# Altium schematic sheet ngh-dram.SchDoc
size A4
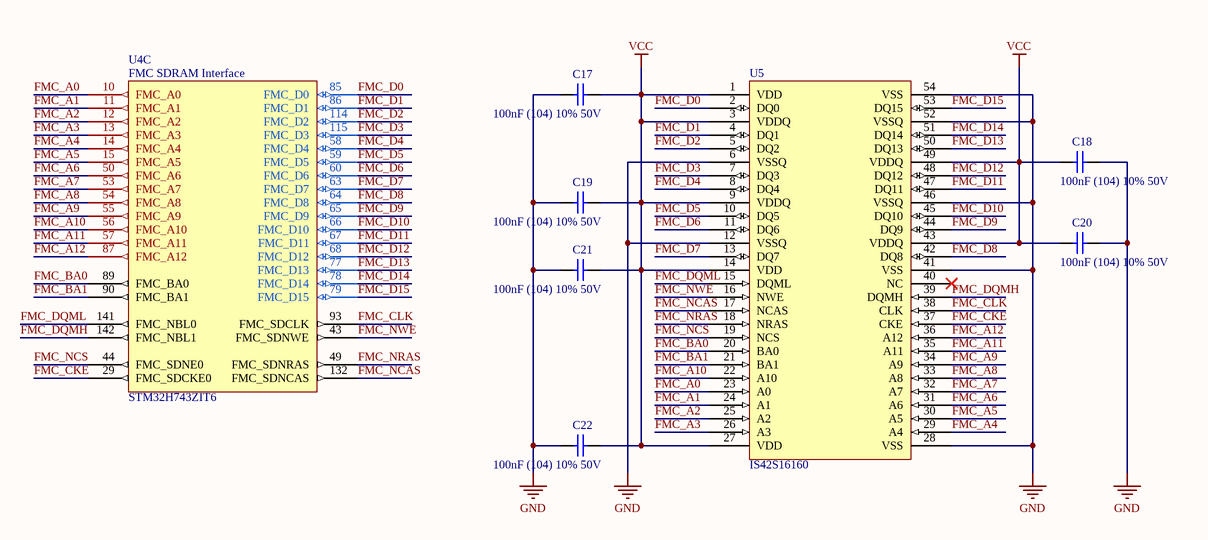
[diagram p0: ngh-dram.SchDoc]

## Parts
C17  100nF (104) 10% 50V  [0603_C]
C18  100nF (104) 10% 50V  [0603_C]
C19  100nF (104) 10% 50V  [0603_C]
C20  100nF (104) 10% 50V  [0603_C]
C21  100nF (104) 10% 50V  [0603_C]
C22  100nF (104) 10% 50V  [0603_C]
U4  STM32H743ZIT6  [LQFP-144_20x20]  (part C of 6)
U5  IS42S16160  [TSOP54-II]

## Nets
GND: C17.2 C18.1 C19.2 C20.1 C21.2 C22.2 U5.6(VSSQ) U5.12(VSSQ) U5.28(VSS) U5.41(VSS) U5.46(VSSQ) U5.52(VSSQ) U5.54(VSS)
VCC: C17.1 C18.2 C19.1 C20.2 C21.1 C22.1 U5.1(VDD) U5.3(VDDQ) U5.9(VDDQ) U5.14(VDD) U5.27(VDD) U5.43(VDDQ) U5.49(VDDQ)
FMC_A0: U4.10(FMC_A0) U5.23(A0)
FMC_A1: U4.11(FMC_A1) U5.24(A1)
FMC_A2: U4.12(FMC_A2) U5.25(A2)
FMC_A3: U4.13(FMC_A3) U5.26(A3)
FMC_A4: U4.14(FMC_A4) U5.29(A4)
FMC_A5: U4.15(FMC_A5) U5.30(A5)
FMC_A6: U4.50(FMC_A6) U5.31(A6)
FMC_A7: U4.53(FMC_A7) U5.32(A7)
FMC_A8: U4.54(FMC_A8) U5.33(A8)
FMC_A9: U4.55(FMC_A9) U5.34(A9)
FMC_A10: U4.56(FMC_A10) U5.22(A10)
FMC_A11: U4.57(FMC_A11) U5.35(A11)
FMC_A12: U4.87(FMC_A12) U5.36(A12)
FMC_BA0: U4.89(FMC_BA0) U5.20(BA0)
FMC_BA1: U4.90(FMC_BA1) U5.21(BA1)
FMC_CKE: U4.29(FMC_SDCKE0) U5.37(CKE)
FMC_CLK: U4.93(FMC_SDCLK) U5.38(CLK)
FMC_D0: U4.85(FMC_D0) U5.2(DQ0)
FMC_D1: U4.86(FMC_D1) U5.4(DQ1)
FMC_D2: U4.114(FMC_D2) U5.5(DQ2)
FMC_D3: U4.115(FMC_D3) U5.7(DQ3)
FMC_D4: U4.58(FMC_D4) U5.8(DQ4)
FMC_D5: U4.59(FMC_D5) U5.10(DQ5)
FMC_D6: U4.60(FMC_D6) U5.11(DQ6)
FMC_D7: U4.63(FMC_D7) U5.13(DQ7)
FMC_D8: U4.64(FMC_D8) U5.42(DQ8)
FMC_D9: U4.65(FMC_D9) U5.44(DQ9)
FMC_D10: U4.66(FMC_D10) U5.45(DQ10)
FMC_D11: U4.67(FMC_D11) U5.47(DQ11)
FMC_D12: U4.68(FMC_D12) U5.48(DQ12)
FMC_D13: U4.77(FMC_D13) U5.50(DQ13)
FMC_D14: U4.78(FMC_D14) U5.51(DQ14)
FMC_D15: U4.79(FMC_D15) U5.53(DQ15)
FMC_DQMH: U4.142(FMC_NBL1) U5.39(DQMH)
FMC_DQML: U4.141(FMC_NBL0) U5.15(DQML)
FMC_NCAS: U4.132(FMC_SDNCAS) U5.17(NCAS)
FMC_NCS: U4.44(FMC_SDNE0) U5.19(NCS)
FMC_NRAS: U4.49(FMC_SDNRAS) U5.18(NRAS)
FMC_NWE: U4.43(FMC_SDNWE) U5.16(NWE)

Not connected (* = marked no-connect by the designer): U5 40(NC)*

## Notes on the sheet
- (in symbol STM32H743ZIT6, part C) FMC SDRAM Interface

## Library data of the parts
C17-C22 = 0603 100nF (104) 10% 50V: 贴片电容; ComponentLink1Description: 供应商链接; ComponentLink1URL: http://www.szlcsc.com/product/details_15331.html; Package: 0603; Supplier: LC; SuppliersPartNumber: C14663